# EAGLE design led-1 (EAGLE 7.6.0)
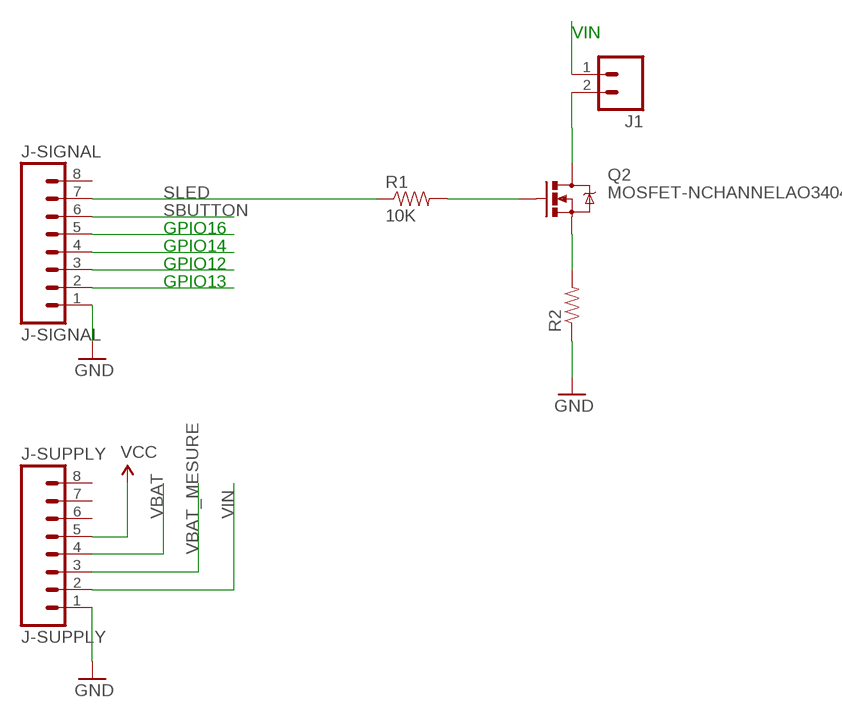
[diagram p0: schematic, sheet 1]

## Parts
J1  M02JST-PTH-VERT  [JST-2-PTH-VERT]
J-SIGNAL  J-SIGNAL  M08  [1X08_ROUND]
J-SUPPLY  J-SUPPLY  M08  [1X08_ROUND]
Q2  MOSFET-NCHANNELAO3404A  [SOT23-3]
R1  10K  RESISTOR0805-RES  [0805]
R2  RESISTORPTH-1/2W  [AXIAL-0.5]

## Nets
GND [SUPPLY]: J-SIGNAL.1 J-SUPPLY.1 R2.P$1
GPIO12: J-SIGNAL.3
GPIO13: J-SIGNAL.2
GPIO14: J-SIGNAL.4
GPIO16: J-SIGNAL.5
N$1 [SUPPLY]: Q2.2(S) R2.P$2
N$2: Q2.1(G) R1.2
N$3 [SUPPLY]: J1.2 Q2.3(D)
SBUTTON: J-SIGNAL.6
SLED: J-SIGNAL.7 R1.1
VBAT [SUPPLY]: J-SUPPLY.4
VBAT_MESURE [SUPPLY]: J-SUPPLY.3
VCC [SUPPLY]: J-SUPPLY.5
VIN [SUPPLY]: J1.1 J-SUPPLY.2
Unconnected: J-SIGNAL.8 J-SUPPLY.6 J-SUPPLY.7 J-SUPPLY.8

## Notes on the sheet
- VIN
- GPIO16
- GPIO14
- GPIO12
- GPIO13

## Library data of the parts
J1 = SparkFun-Connectors:M02: Standard 2-pin 0.1" header. Use with - straight break away headers ( PRT-00116) - right angle break away headers (PRT-00553) - swiss pins (PRT-00743) - machine pins (PRT-00117) - female headers (PRT-00115) Molex polarized connector foot print use with: PRT-08233 with associated crimp pins and housings. 2.54_SCREWTERM for use with PRT-10571. 3.5mm Screw Terminal footprints for PRT-08084 5mm Screw Terminal footprints for use with PRT-08432
J-SIGNAL J-SUPPLY = SparkFun-Connectors:M08: Header 8 Standard 8-pin 0.1" header. Use with straight break away headers (SKU : PRT-00116), right angle break away headers (PRT-00553), swiss pins (PRT-00743), machine pins (PRT-00117), and female headers (PRT-00115).; PROD_ID: CONN-08437
Q2 = SparkFun-DiscreteSemi:MOSFET-NCHANNEL: Common NMOSFET Parts MFG P/N Store ID Prod ID FDD8780 TRANS-09984 SI7820DN TRANS-11055 FDS6630A IC-08089 2N7002PW TRANS-11151 FQP30N06L COM-10213 TRANS-10060 BSS123LT1G TRANS-08345 BSS138 TRANS-00830 BS170 2N7000; PROD_ID: TRAN-12988
R1 R2 = SparkFun-Passives:RESISTOR: Resistor Basic schematic elements and footprints for 0603, 1206, and PTH resistors.

## Net classes
0 default: width 0.3 mm
1 GND: width 0.5 mm, clearance 0.5 mm
2 SUPPLY: width 0.5 mm, clearance 0.003 mm

## Board
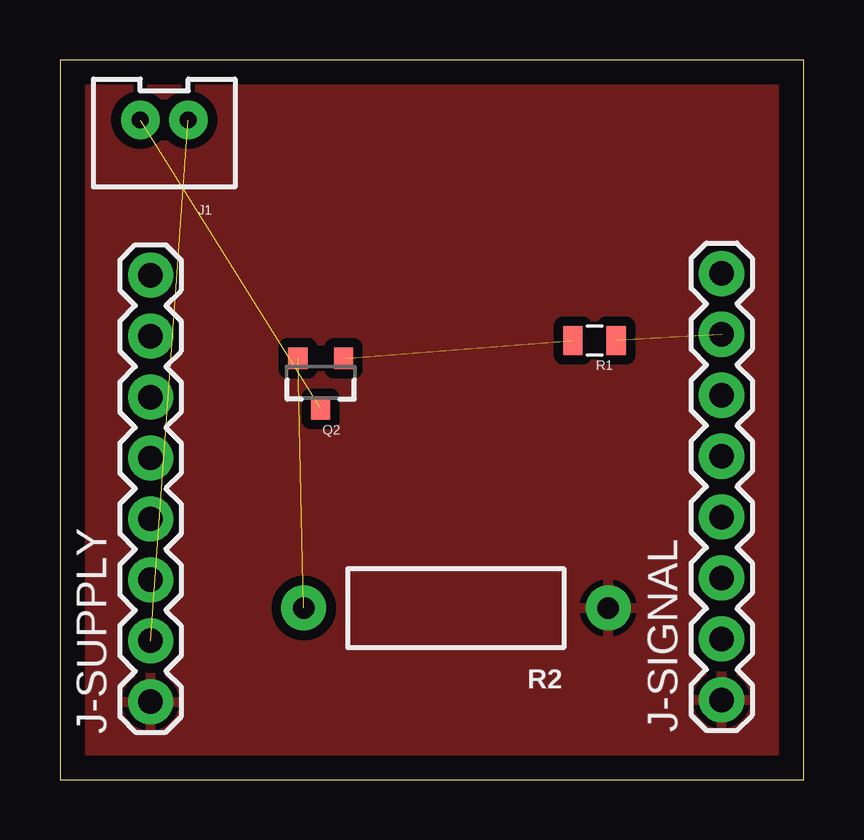
[diagram p1: board, top side]

Size 31 x 30 mm. Coordinates in mm from the lower left corner, seen from the top.
Outline: 0,0 31,0 31,30 0,30 0,0
Copper layers (1*16): Top 0.035mm / dielectric 1.5mm / Bottom 0.035mm
Design rules "default": minimum track width 10mil, minimum drill 24mil, track to track 8mil, track to pad 8mil, pad to pad 8mil, via to via 8mil, smd to smd 8mil, copper to edge 40mil, drill to drill 8mil, minimum pad ring 10mil, minimum via ring 8mil, stop-mask expansion 4mil, vias tented up to drill 0mil, thermal gap 10mil

### Footprints (pad centres in the part's own frame; a part is rotated, then mirrored left to right if it is on the bottom)
JST-2-PTH-VERT = drill 0.7 pad 1.6: 1 -1,-0.55; 2 1,-0.55
1X08_ROUND = drill 1.016 pad 1.88: 1 0,0; 2 2.54,0; 3 5.08,0; 4 7.62,0; 5 10.16,0; 6 12.7,0; 7 15.24,0; 8 17.78,0
SOT23-3 = smd 0.8 x 0.9: 1 -0.95,-1; 2 0.95,-1; 3 0,1.1
0805 = smd 0.8 x 1.2: 1 -0.9,0; 2 0.9,0
AXIAL-0.5 = drill 0.9 pad 1.88: P$1 -6.35,0; P$2 6.35,0

### Placement (x,y rotation side)
J1  4.35,26.95 180 top
J-SIGNAL  27.59,3.32 90 top
J-SUPPLY  3.78,3.25 90 top
Q2  10.87,16.56 180 top
R1  22.29,18.3 180 top
R2  16.51,7.15 180 top

### Tracks (layer width: path | path; a pad name or v marks a point on that pad's centre or on a via)
GND
  pour Top (isolate 0.406): 0,30 31,30 31,0 0,0
N$1  (1 unrouted)
N$2  (1 unrouted)
N$3  (1 unrouted)
SLED  (1 unrouted)
VIN  (1 unrouted)